# EAGLE design releBoard_v20 (EAGLE 6.2)
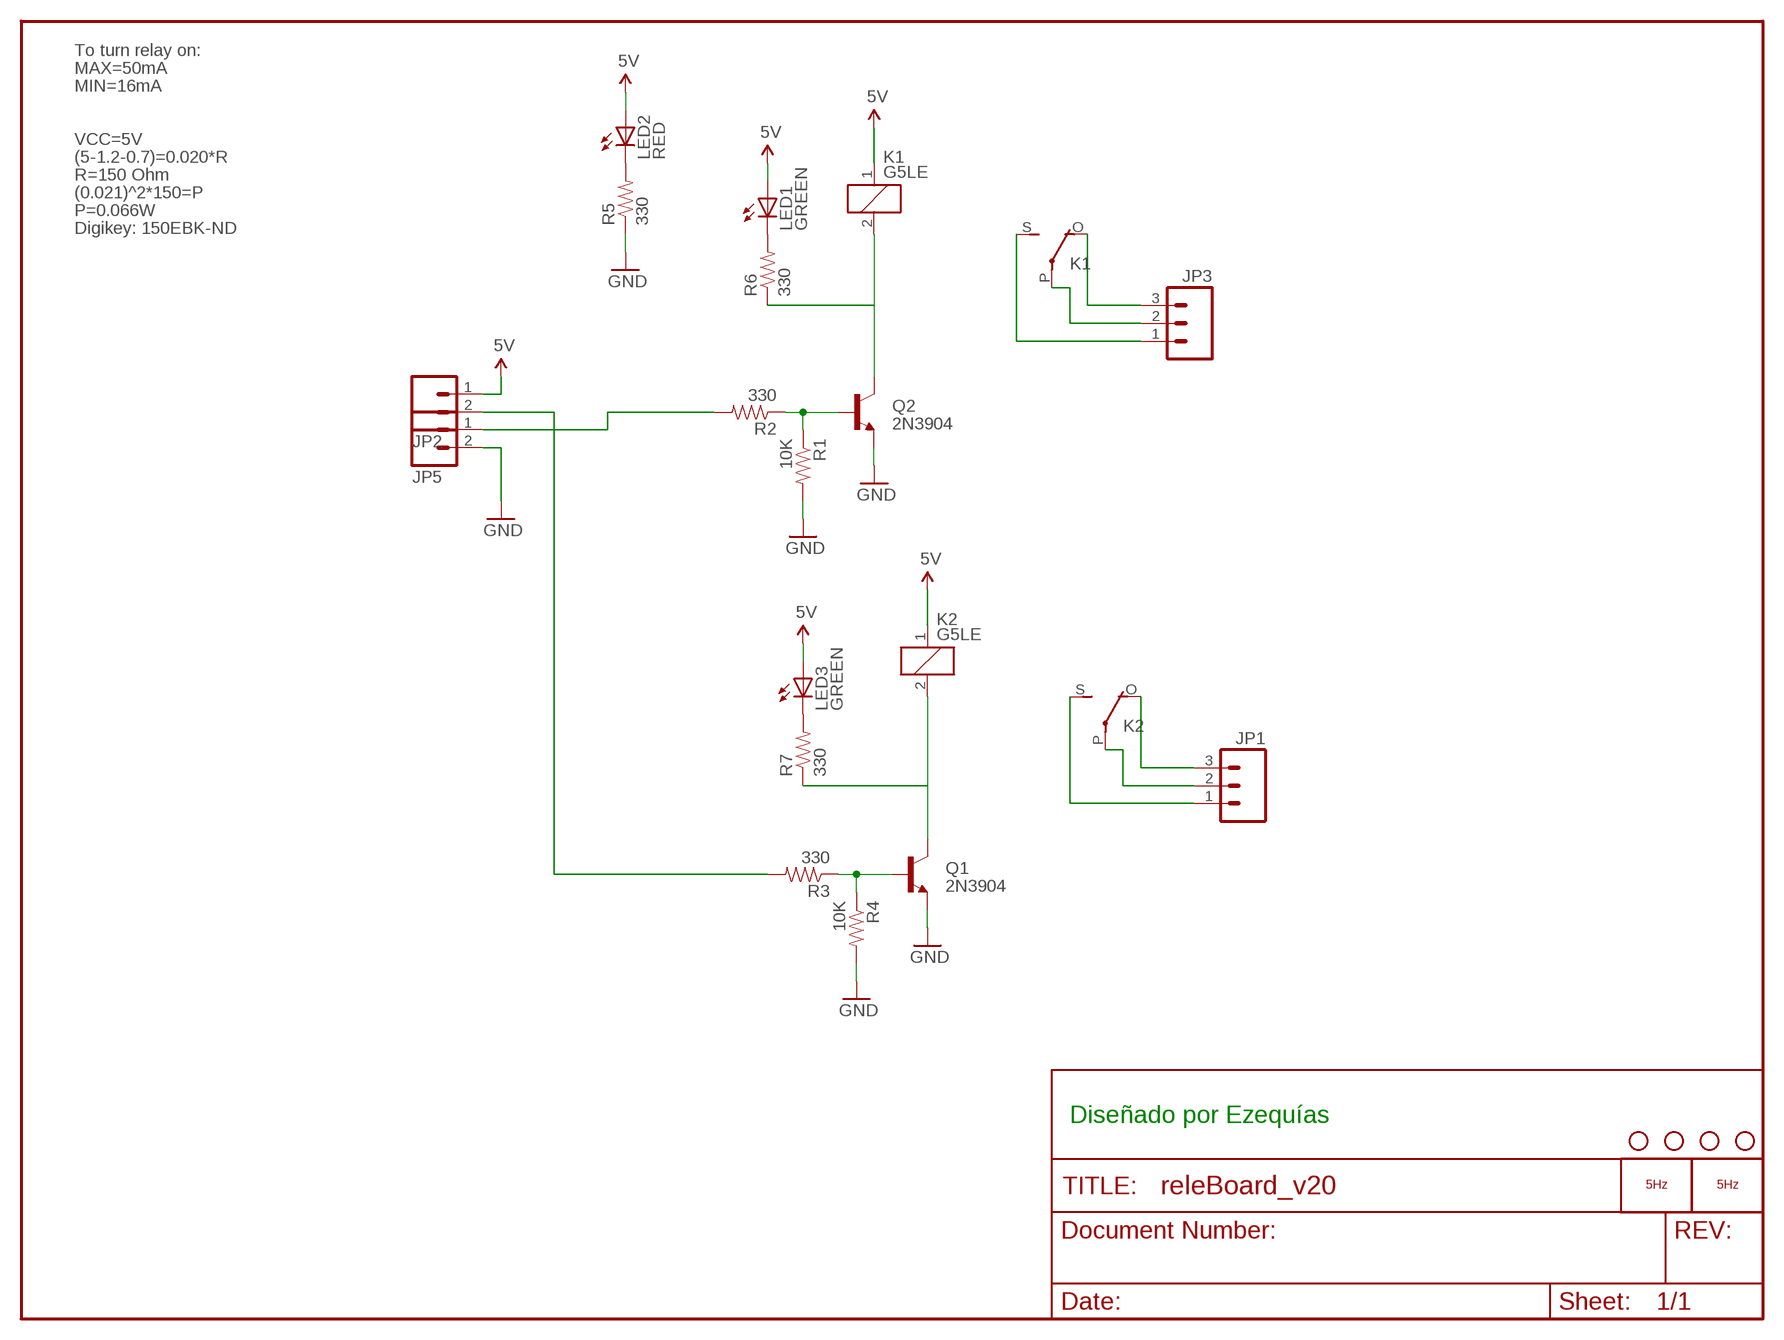
[diagram p0: schematic, sheet 1]

## Parts
JP1  M03-SCREW-5MM  [SCREWTERMINAL-5MM-3]
JP2  M025MM  [SCREWTERMINAL-5MM-2]
JP3  M03-SCREW-5MM  [SCREWTERMINAL-5MM-3]
JP5  M025MM  [SCREWTERMINAL-5MM-2]
K1  G5LE  [G5LE]
K2  G5LE  [G5LE]
LED1  GREEN  LED0603  [LED-0603]
LED2  RED  LED0603  [LED-0603]
LED3  GREEN  LED0603  [LED-0603]
LOGO1  LOGO_5HZ_H_15MM  [5HZ_LOGO_H_15MM]
LOGO2  LOGO_5HZ_WEB_COOPER_10MM  [5HZ_WEB_COOPER_10MM]
Q1  2N3904  TRANSISTOR_NPNSOT23  [SOT23]
Q2  2N3904  TRANSISTOR_NPNSOT23  [SOT23]
R1  10K  RESISTOR0603-RES  [0603-RES]
R2  330  RESISTOR0603-RES  [0603-RES]
R3  330  RESISTOR0603-RES  [0603-RES]
R4  10K  RESISTOR0603-RES  [0603-RES]
R5  330  RESISTOR0603-RES  [0603-RES]
R6  330  RESISTOR0603-RES  [0603-RES]
R7  330  RESISTOR0603-RES  [0603-RES]
U$3  STAND-OFF  [STAND-OFF]
U$4  STAND-OFF  [STAND-OFF]
U$5  STAND-OFF  [STAND-OFF]
U$7  STAND-OFF  [STAND-OFF]

## Nets
5V: JP2.1 K1.1 K2.1 LED1.A LED2.A LED3.A
COIL: K1.2 Q2.3(C) R6.1
COIL1: K2.2 Q1.3(C) R7.1
GND: JP5.2 Q1.2(E) Q2.2(E) R1.2 R4.2 R5.1
LINE: JP3.2 K1.P(2:P)
LINE1: JP1.2 K2.P(2:P)
N$1: JP5.1 R2.2
N$2: Q1.1(B) R3.1 R4.1
N$3: LED1.C R6.2
N$4: LED2.C R5.2
N$5: JP2.2 R3.2
N$6: Q2.1(B) R1.1 R2.1
N$7: LED3.C R7.2
NC: JP3.3 K1.O(2:O)
NC1: JP1.3 K2.O(2:O)
NO: JP3.1 K1.S(2:S)
NO1: JP1.1 K2.S(2:S)

## Notes on the sheet
- To turn relay on:
- MAX=50mA
- MIN=16mA
- VCC=5V
- (5-1.2-0.7)=0.020*R
- R=150 Ohm
- (0.021)^2*150=P
- P=0.066W
- Digikey: 150EBK-ND
- Diseñado por Ezequías

## Library data of the parts
JP1 JP3 = SparkFun:M03: Header 3 Standard 3-pin 0.1" header. Use with straight break away headers (SKU : PRT-00116), right angle break away headers (PRT-00553), swiss pins (PRT-00743), machine pins (PRT-00117), and female headers (PRT-00115). Molex polarized connector foot print use with SKU : PRT-08232 with associated crimp pins and housings.
JP2 JP5 = SparkFun_old:M02: Header 2 Standard 2-pin 0.1" header. Use with straight break away headers (SKU : PRT-00116), right angle break away headers (PRT-00553), swiss pins (PRT-00743), machine pins (PRT-00117), and female headers (PRT-00115). Molex polarized connector foot print use with SKU : PRT-08233 with associated crimp pins and housings.
K1 K2 = relay:G5LE: RELAY 1 x switch, 10 A/120 V AC, 8 A/30 V DC, Omron; OC_FARNELL: unknown; OC_NEWARK: unknown
LED1-LED3 = SparkFun:LED: LEDs Standard schematic elements and footprints for 5mm, 3mm, 1206, and 0603 sized LEDs. 5mm - Spark Fun Electronics SKU : COM-00529 (and others)
LOGO1 LOGO2 = 5hz-electronica:LOGO_5HZ: Logotipo 5Hz "según Pedro"
Q1 Q2 = SparkFun:TRANSISTOR_NPN: Transistor NPN BJT configuration in SOT23 package. MMBT2222 is the common NPN we use. Double check BCE configuration again layout.
R1-R7 = SparkFun:RESISTOR: Resistor Basic schematic elements and footprints for 0603, 1206, and PTH resistors.
U$3-U$5 U$7 = SparkFun:STAND-OFF: Stand Off This is the mechanical footprint for a #4 phillips button head screw. Use the keepout ring to avoid running the screw head into surrounding components. SKU : PRT-00447

## Board
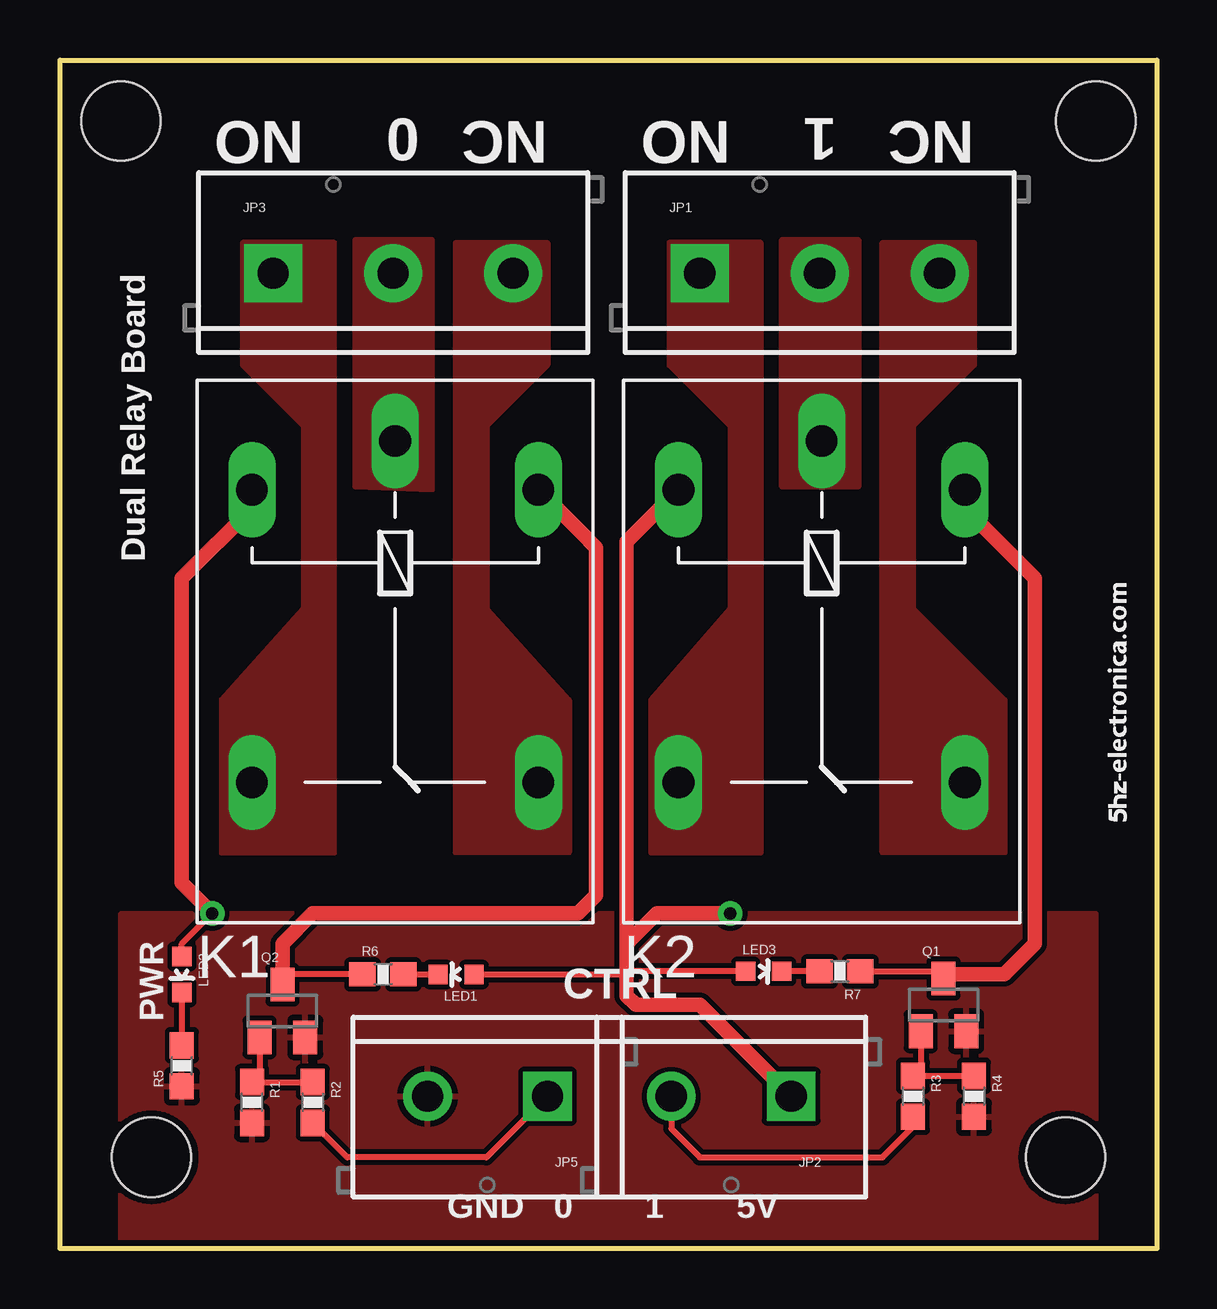
[diagram p1: board, top side]
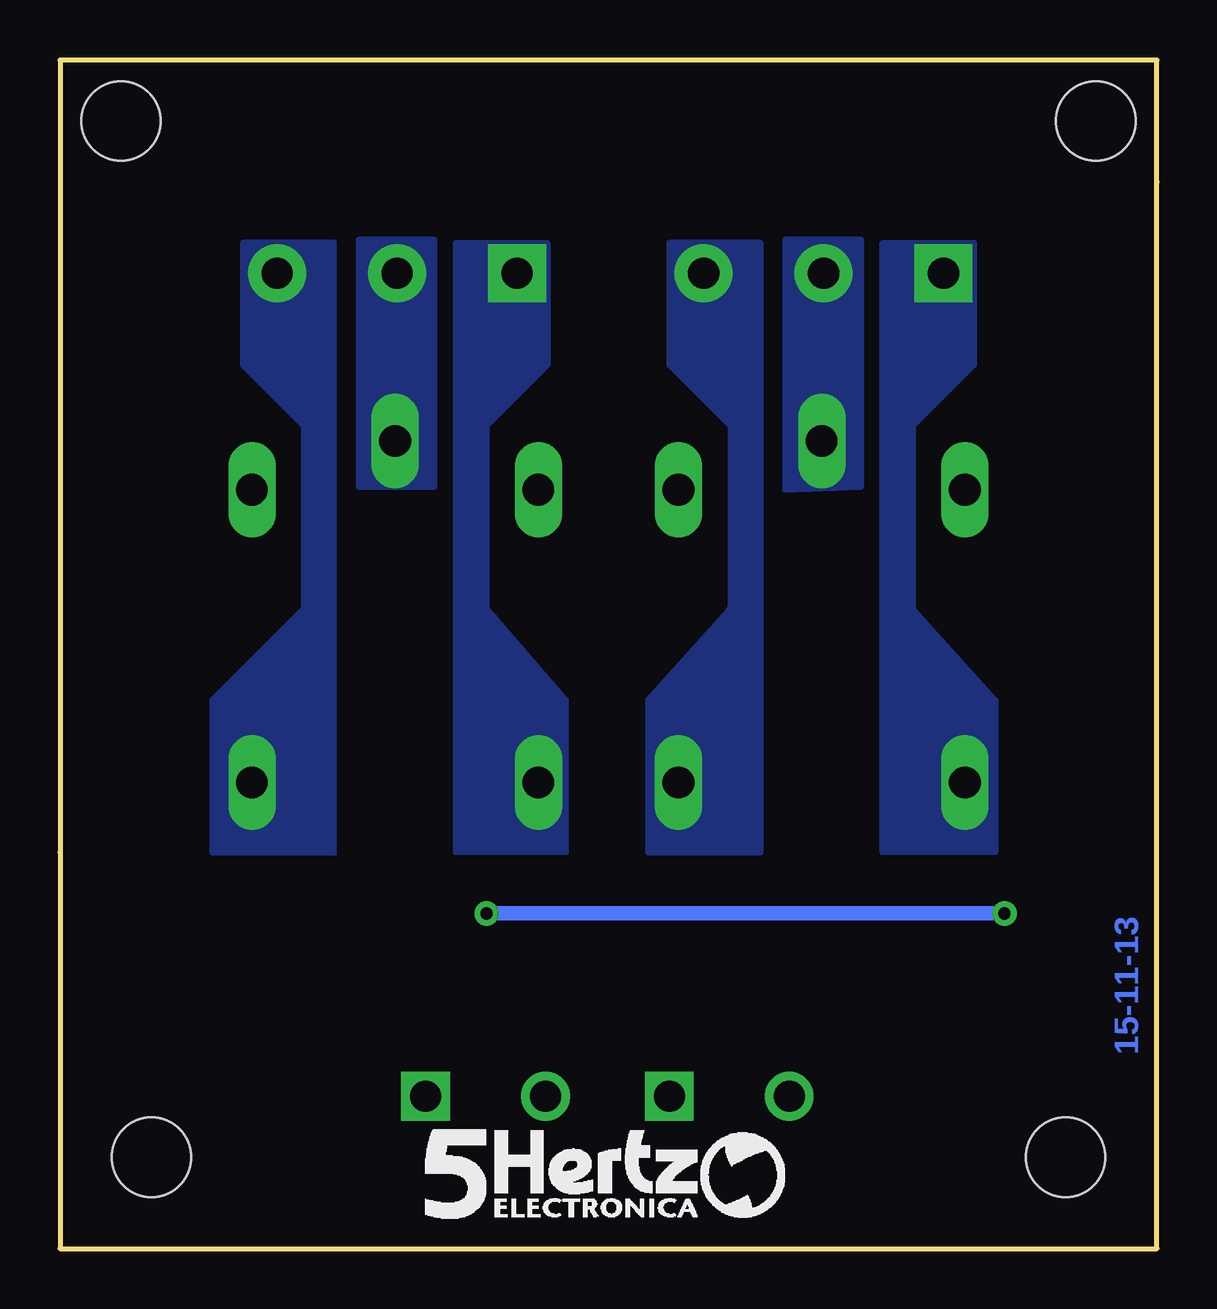
[diagram p2: board, bottom side, seen from below]

Size 45.72 x 49.53 mm. Coordinates in mm from the lower left corner, seen from the top.
Outline: 0,49.53 45.72,49.53 45.72,16.51 45.72,0 0,0 0,44.45 0,49.53
Copper layers (1*16): Top 0.035mm / dielectric 1.5mm / Bottom 0.035mm
Design rules: minimum track width 8mil, minimum drill 20mil, track to track 8mil, track to pad 8mil, pad to pad 8mil, via to via 8mil, smd to smd 8mil, copper to edge 10mil, drill to drill 8mil, minimum pad ring 12mil, minimum via ring 10mil, stop-mask expansion 4mil, vias tented up to drill 25mil, thermal gap 10mil

### Footprints (pad centres in the part's own frame; a part is rotated, then mirrored left to right if it is on the bottom)
SCREWTERMINAL-5MM-3 = drill 1.3 pad 2.413 square: 1 0,0 | drill 1.3 pad 2.413: 2 5,0; 3 10,0
SCREWTERMINAL-5MM-2 = drill 1.3 pad 2.032 square: 1 0,0 | drill 1.3 pad 2.032: 2 5,0
G5LE = drill 1.321 long: 1 -7.493,-5.969; 2 -7.493,5.969; O 4.699,5.969; P -9.525,0; S 4.699,-5.969
LED-0603 = smd 0.8 x 0.8: A 0,-0.75; C 0,0.75
SOT23 = smd 1 x 1.4: 1 -0.95,-1.1; 2 0.95,-1.1; 3 0,1.1
0603-RES = smd 1.1 x 1: 1 -0.85,0; 2 0.85,0
STAND-OFF = hole 3.302: 0,0

### Placement (x,y rotation side)
JP1  26.67,40.64 0 top
JP2  30.48,6.35 180 top
JP3  8.89,40.64 0 top
JP5  20.32,6.35 180 top
K1  13.97,24.13 270 top
K2  31.75,24.13 270 top
LED1  16.51,11.43 90 top
LED2  5.08,11.43 180 top
LED3  29.34,11.56 270 top
LOGO1  30.48,1.27 0 bottom
LOGO2  44.45,17.78 90 top
Q1  36.83,10.16 0 top
Q2  9.27,9.91 0 top
R1  8,6.1 270 top
R2  10.54,6.1 270 top
R3  35.56,6.35 270 top
R4  38.1,6.35 270 top
R5  5.08,7.62 90 top
R6  13.46,11.43 0 top
R7  32.51,11.56 180 top
U$3  3.81,3.81 270 top
U$4  2.54,46.99 270 top
U$5  43.18,46.99 270 top
U$7  41.91,3.81 270 top

### Tracks (layer width: path | path; a pad name or v marks a point on that pad's centre or on a via)
5V  (via drill 0.51)
  Top 0.254: LED2.A 5.08,12.7 v6.35,13.97 | LED1.A 17.78,11.43 22.35,11.43 23.62,11.43 23.75,11.56 24.38,11.56 LED3.A | 23.62,11.81 23.62,11.94
  Top 0.406: 23.62,12.06 23.62,11.94 23.62,11.81
  Top 0.61: 23.62,12.57 23.62,12.95 | 23.62,12.95 23.62,12.57 | 23.62,12.57 23.62,11.94 | 23.62,11.94 23.62,12.57 | 23.62,12.57 23.62,12.7 | 23.62,12.7 23.62,12.95 | 23.62,12.95 23.62,13.97 23.62,29.46 K2.1 | K1.1 8,30.86 5.08,27.94 5.08,15.24 v6.35,13.97 | v27.94,13.97 24.89,13.97 23.62,12.7 | JP2.1 26.67,10.16 24,10.16 23.62,10.54 23.62,11.43 23.62,11.81 23.62,11.94 | 23.62,11.94 23.62,12.06
  Bottom 0.61: v6.35,13.97 v27.94,13.97
COIL
  Top 0.254: R6.1 9.31,11.43 Q2.3
  Top 0.61: K1.2 20.07,31.5 21.72,29.84 22.35,29.21 22.35,14.73 21.59,13.97 16.51,13.97 10.54,13.97 9.27,12.7 Q2.3 9.31,11.43
COIL1
  Top 0.254: R7.1 36.53,11.56 Q1.3
  Top 0.61: K2.2 37.72,30.86 40.64,27.94 40.64,12.7 39.37,11.43 37,11.43 Q1.3
GND
  pour Top: 2.54,13.97 43.18,13.97 43.18,0 2.54,0
LINE
  pour Top (no thermals): 15.49,42.04 15.49,31.62 12.32,31.75 12.32,42.04
  pour Bottom (no thermals): 15.49,42.04 15.49,31.62 12.32,31.75 12.32,42.04
  pour Top (no thermals): 15.49,42.04 15.49,31.62 12.32,31.75 12.32,42.04
  pour Top (no thermals): 15.49,42.04 15.49,31.62 12.32,31.75 12.32,42.04
LINE1
  pour Bottom (no thermals): 33.27,42.04 33.27,31.75 30.1,31.75 30.1,42.04
  pour Top (no thermals): 33.27,42.04 33.27,31.75 30.1,31.75 30.1,42.04
N$1
  Top 0.254: 10.54,4.83 R2.2 11.98,3.81 17.78,3.81 JP5.1
N$2
  Top 0.254: Q1.1 35.88,7.52 R3.1 R4.1
N$3
  Top 0.254: R6.2 LED1.C
N$4
  Top 0.254: LED2.C R5.2
N$5
  Top 0.254: JP2.2 25.48,5 26.67,3.81 34.29,3.81 35.56,5.08 R3.2
N$6
  Top 0.254: Q2.1 8.32,7.27 R1.1 R2.1
N$7
  Top 0.254: R7.2 LED3.C
NC
  pour Top (no thermals): 20.32,41.91 20.32,36.83 17.78,34.29 17.78,26.67 21.21,22.86 21.21,16.51 16.51,16.51 16.51,41.91
  pour Bottom (no thermals): 20.32,41.91 20.32,36.83 17.78,34.29 17.78,26.67 21.21,22.86 21.21,16.51 16.51,16.51 16.51,41.91
NC1
  pour Bottom (no thermals): 38.1,41.91 38.1,36.83 35.56,34.29 35.56,26.67 39.37,22.86 39.37,16.51 34.29,16.51 34.29,41.91
  pour Top (no thermals): 38.1,41.91 38.1,36.83 35.56,34.29 35.56,26.67 39.37,22.86 39.37,16.51 34.29,16.51 34.29,41.91
NO
  pour Bottom (no thermals): 7.62,41.91 7.62,36.83 10.16,34.29 10.16,26.67 6.73,22.86 6.73,16.51 11.43,16.51 11.43,41.91
  pour Top (no thermals): 7.62,41.91 7.62,36.83 10.16,34.29 10.16,26.67 6.73,22.86 6.73,16.51 11.43,16.51 11.43,41.91
NO1
  pour Top (no thermals): 25.4,41.91 25.4,36.83 27.94,34.29 27.94,26.67 24.64,22.86 24.64,16.51 29.21,16.51 29.21,41.91
  pour Bottom (no thermals): 25.4,41.91 25.4,36.83 27.94,34.29 27.94,26.67 24.64,22.86 24.64,16.51 29.21,16.51 29.21,41.91

### Text on the board
Bottom: 15-11-13
tPlace: NO | 0 | NC | NO | 1 | NC | Dual Relay Board | PWR | CTRL | GND | 0 | 1 | 5V